# EAGLE design rain (EAGLE 6.5.0)
AUTHOR: Brad Campbell; REV: A; TITLE: Rain
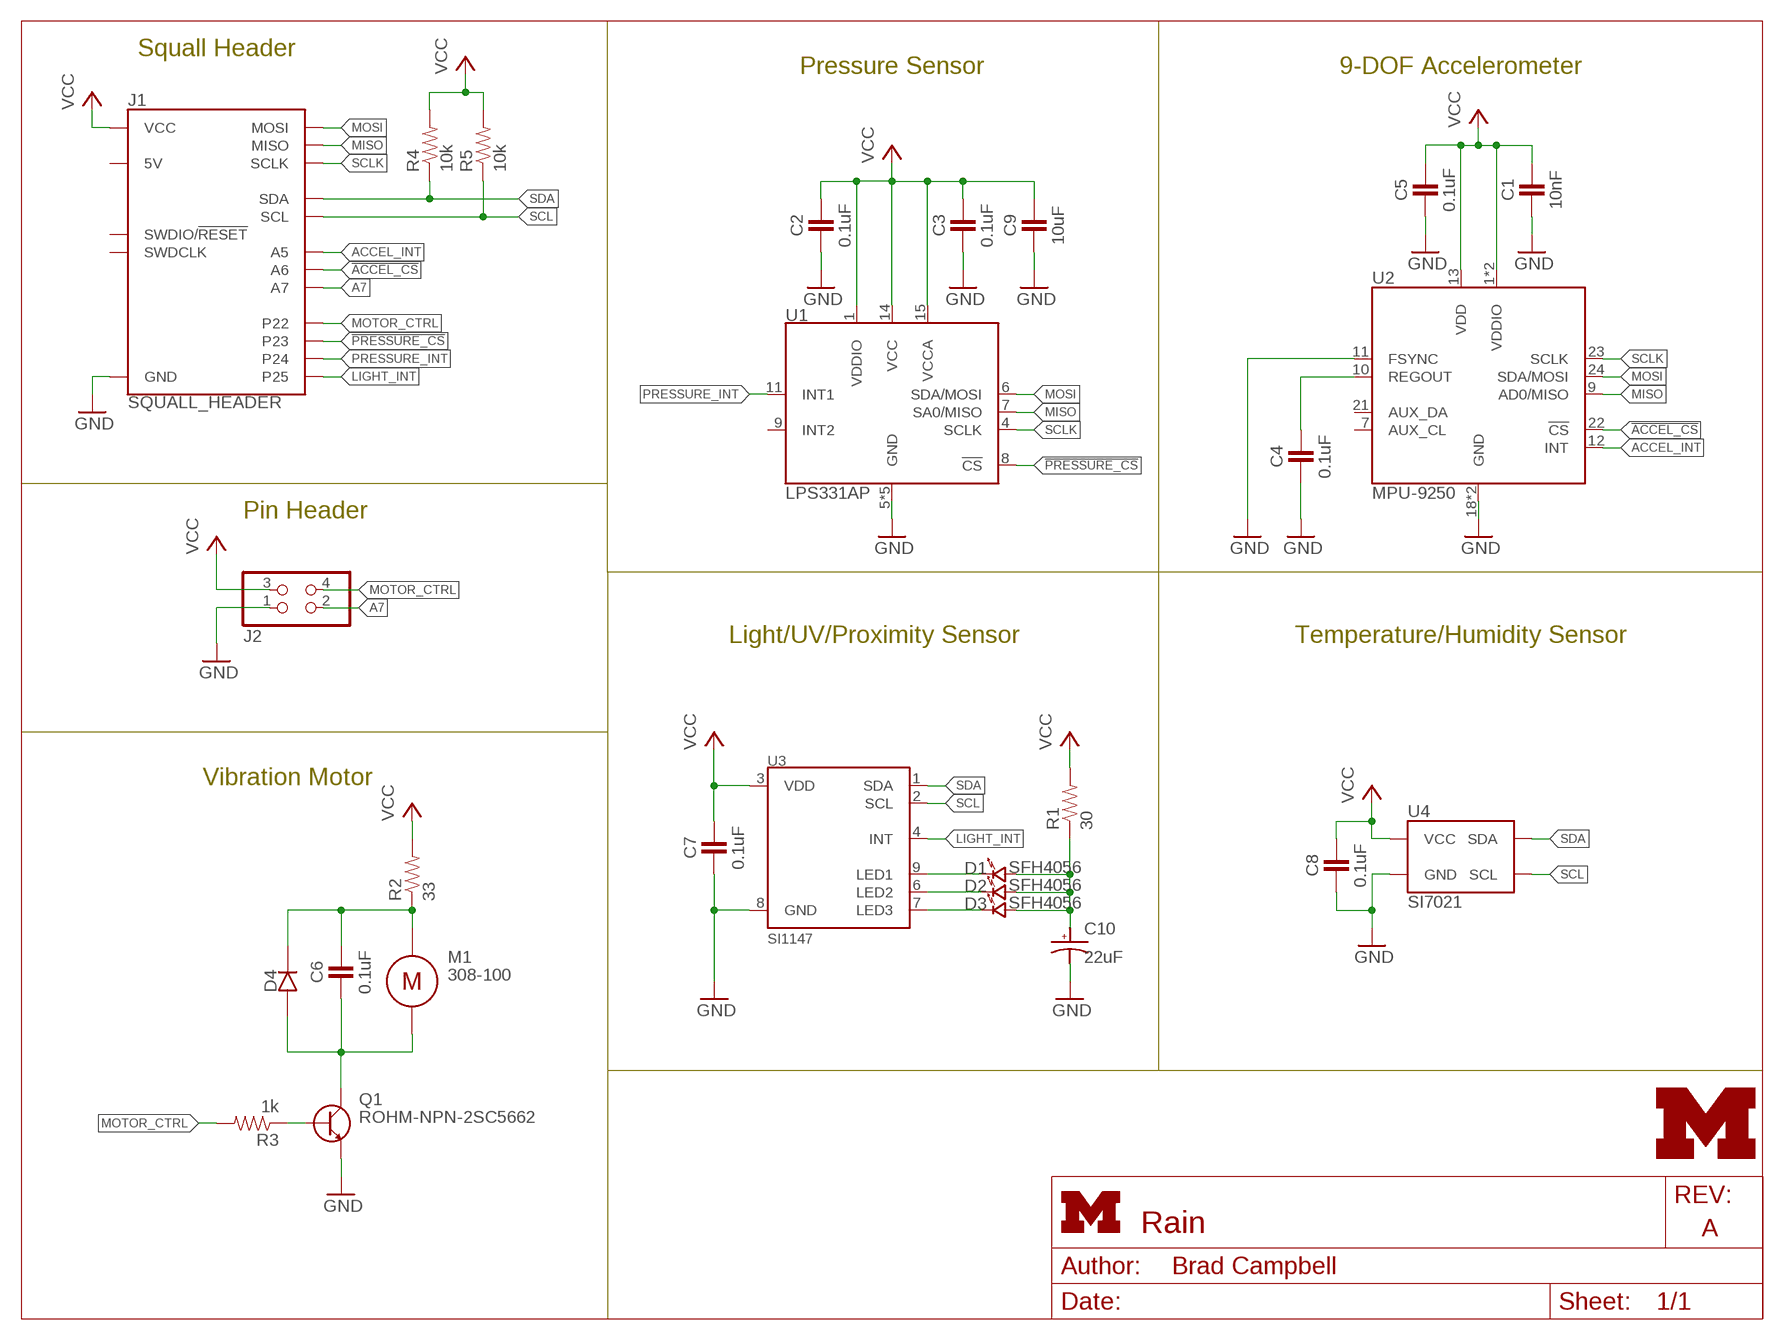
[diagram p0: schematic, sheet 1]
FRAME1 (LETTER_L): HEIGHT: 8.5in; WIDTH: 11in

## Parts
C1  10nF  CAPACITOR  [0402_CAP]
C2  0.1uF  CAPACITOR  [0402_CAP]
C3  0.1uF  CAPACITOR  [0402_CAP]
C4  0.1uF  CAPACITOR  [0402_CAP]
C5  0.1uF  CAPACITOR  [0402_CAP]
C6  0.1uF  CAPACITOR  [0402_CAP]
C7  0.1uF  CAPACITOR  [0402_CAP]
C8  0.1uF  CAPACITOR  [0402_CAP]
C9  10uF  CAPACITOR  [0402_CAP]
C10  22uF  CAP_POL0603  [CAP0603]
D1  SFH4056  [SFH4056]
D2  SFH4056  [SFH4056]
D3  SFH4056  [SFH4056]
D4  DIODE  [0402_DIODE]
J1  SQUALL_HEADER  [SQUALL_HEADER]
J2  PINHD-2X2  [2X02]
LOGO1  UMICH_SOLID_TINY  [UMICH_SOLID_50MIL]
M1  308-100  [308-100]
Q1  ROHM-NPN-2SC5662  [VMT3]
R1  30  RESISTOR0402_RES  [0402_RES]
R2  33  RESISTOR0402_RES  [0402_RES]
R3  1k  RESISTOR0402_RES  [0402_RES]
R4  10k  RESISTOR0402_RES  [0402_RES]
R5  10k  RESISTOR0402_RES  [0402_RES]
U1  LPS331AP  [HCLGA-16/3MM]
U2  MPU-9250  [QFN-24/3MM]
U3  SI1147  [QFN-10/2MM]
U4  SI7021  [DFN-6/3MM]

## Nets
!ACCEL_CS: J1.B7(A6) U2.22(!CS)
!PRESSURE_CS: J1.A4(P23) U1.8(!CS)
A7: J1.B5(A7) J2.2
ACCEL_INT: J1.B9(A5) U2.12(INT)
GND: C1.2 C2.2 C3.2 C4.2 C5.2 C7.2 C8.2 C9.2 C10.NEG(ANODE) J1.A9(GND) J1.A10(GND) J2.1 Q1.2(EMITTER) U1.5(GND) U1.10(GND) U1.12(GND) U1.13(GND) U1.16(GND) U2.11(FSYNC) U2.18(GND) U2.20(GND) U3.8(GND) U4.2(GND)
LIGHT_INT: J1.A8(P25) U3.4(INT)
MISO: J1.B8(MISO) U1.7(SA0/MISO) U2.9(AD0/MISO)
MOSI: J1.B6(MOSI) U1.6(SDA/MOSI) U2.24(SDA/MOSI)
MOTOR_CTRL: J1.A2(P22) J2.4 R3.2
N$1: C6.1 D4.CATHODE M1.POS R2.1
N$2: C6.2 D4.ANODE M1.NEG Q1.3(COLLECTOR)
N$3: C4.1 U2.10(REGOUT)
N$4: D1.CATHODE U3.9(LED1)
N$5: Q1.1(BASE) R3.1
N$6: D2.CATHODE U3.6(LED2)
N$7: D3.CATHODE U3.7(LED3)
N$8: C10.POS(CATHODE) D1.ANODE D2.ANODE D3.ANODE R1.1
PRESSURE_INT: J1.A6(P24) U1.11(INT1)
SCL: J1.B3(SCL) R5.1 U3.2(SCL) U4.6(SCL)
SCLK: J1.B10(SCLK) U1.4(SCLK) U2.23(SCLK)
SDA: J1.B1(SDA) R4.1 U3.1(SDA) U4.1(SDA)
VCC: C1.1 C2.1 C3.1 C5.1 C7.1 C8.1 C9.1 J1.A1(VCC) J1.A3(VCC) J2.3 R1.2 R2.2 R4.2 R5.2 U1.1(VDDIO) U1.14(VCC) U1.15(VCCA) U2.1(VDDIO) U2.8(VDDIO) U2.13(VDD) U3.3(VDD) U4.5(VCC)
Unconnected: J1.A5(5V) J1.A7(5V) J1.B2(SWDCLK) J1.B4(SWDIO/!RESET) U1.9(INT2) U2.7(AUX_CL) U2.21(AUX_DA)

## Notes on the sheet
- Squall Header
- Pressure Sensor | 9-DOF Accelerometer
- Pin Header
- Light/UV/Proximity Sensor | Temperature/Humidity Sensor
- Vibration Motor

## Library data of the parts
C1 = passives:CAPACITOR: 0402 Capacitor; DIGIKEY: 490-1312-1-ND
C2-C8 = passives:CAPACITOR: 0402 Capacitor; DIGIKEY: 490-1318-1-ND
C9 = passives:CAPACITOR: 0402 Capacitor; DIGIKEY: 445-8919-1-ND
C10 = passives:CAP_POL; DIGIKEY: 511-1493-1-ND
D1-D3 = leds:SFH4056: LED IR EMITTER 850NM; DIGIKEY: 475-3042-1-ND
D4 = passives:DIODE; DIGIKEY: 641-1277-1-nd
J1 = squall:SQUALL_HEADER: Header for a sensor board on top of the Squall BLE tag board. Requires two DF40C-10DS-0.4V(51).; DIGIKEY: H11617CT-ND
J2 = pinhead:PINHD-2X2: PIN HEADER; DIGIKEY: 609-3201-ND
LOGO1 = logos:UMICH_SOLID
M1 = motor:308-100: Pico Vibe 8mm Vibration Motor - 3mm Type; PRECISION_MICRODRIVES: 308-100
Q1 = fets:ROHM-NPN-2SC5662; DIGIKEY: 2SC5662T2LPCT-ND
R1 = passives:RESISTOR: Resistor Basic schematic elements and footprints for 0603, 1206, and PTH resistors.; DIGIKEY: RHM30CECT-ND
R2 = passives:RESISTOR: Resistor Basic schematic elements and footprints for 0603, 1206, and PTH resistors.; DIGIKEY: RHM33CECT-ND
R3 = passives:RESISTOR: Resistor Basic schematic elements and footprints for 0603, 1206, and PTH resistors.; DIGIKEY: RHM1.0KCECT-ND
R4 R5 = passives:RESISTOR: Resistor Basic schematic elements and footprints for 0603, 1206, and PTH resistors.; DIGIKEY: RHM10.0KCDCT-ND
U1 = chips:LPS331AP: IC PRESSURE SENSOR PIEZO 16HCLGA; DIGIKEY: 497-12927-1-ND
U2 = chips:MPU-9250: GYRO/ACCEL/COMPASS/9-AXIS; DIGIKEY: 1428-1019-1-ND
U3 = chips:SI1147: SENSOR DGTL UV INDEX 10QFN; DIGIKEY: 336-2624-1-ND
U4 = chips:SI7021: IC TEMP SENSOR RH 2% DFN; DIGIKEY: 336-2542-1-ND

## Board
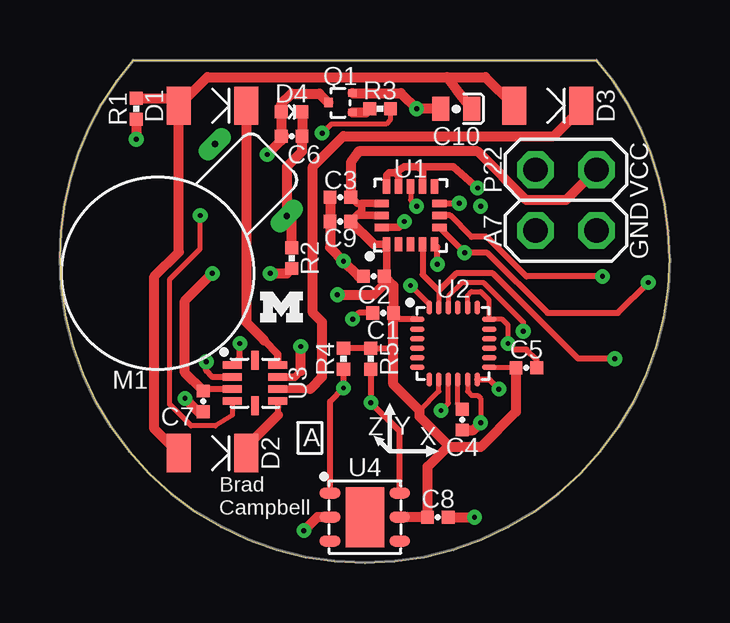
[diagram p1: board, top side]
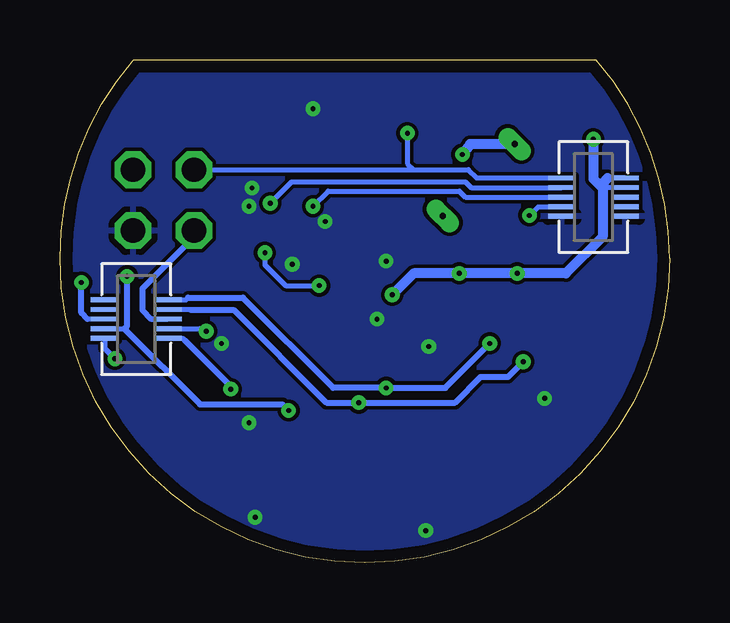
[diagram p2: board, bottom side, seen from below]

Size 25.4 x 20.95 mm. Coordinates in mm from the lower left corner, seen from the top.
Outline: 0,12.7 arc180 25.4,12.7 arc41 22.35,20.95 3.05,20.95 arc41 0,12.7
Copper layers (1*16): Top 0.0178mm / dielectric 59mil / Bottom 0.0178mm
Design rules "sunstone-2lyr_v1.0.0.3": minimum track width 6mil, minimum drill 14mil, track to track 6mil, track to pad 6mil, pad to pad 6mil, via to via 6mil, smd to smd 6mil, copper to edge 20mil, drill to drill 16mil, minimum pad ring 8mil, minimum via ring 8mil, stop-mask expansion 3mil, vias tented up to drill 0mil, thermal gap 10mil

### Footprints (pad centres in the part's own frame; a part is rotated, then mirrored left to right if it is on the bottom)
0402_CAP = smd 0.536 x 0.546: 1 -0.433,0; 2 0.433,0
CAP0603 = smd 0.7 x 1: NEG 0.65,0; POS -0.65,0
SFH4056 = smd 1 x 1.6: ANODE 1.4,0; CATHODE -1.4,0
0402_DIODE = smd 0.536 x 0.546: ANODE -0.433,0; CATHODE 0.433,0
SQUALL_HEADER = smd 1.14 x 0.2 bottom: A1 -10.845,3.34; A2 -8.205,3.34; A3 -10.845,2.94; A4 -8.205,2.94; A5 -10.845,2.54; A6 -8.205,2.54; A7 -10.845,2.14; A8 -8.205,2.14; A9 -10.845,1.74; A10 -8.205,1.74; B1 8.205,-1.74; B2 10.845,-1.74; B3 8.205,-2.14; B4 10.845,-2.14; B5 8.205,-2.54; B6 10.845,-2.54; B7 8.205,-2.94; B8 10.845,-2.94; B9 8.205,-3.34; B10 10.845,-3.34
2X02 = drill 1.016 octagon: 1 -1.27,-1.27; 2 -1.27,1.27; 3 1.27,-1.27; 4 1.27,1.27
308-100 = drill 0.26 pad 0.8 long: NEG -5.5,-2.119; POS -5.5,2.119
VMT3 = smd 0.3 x 0.35: 1 -0.4,-0.5; 2 0.4,-0.5 | smd 0.4 x 0.35: 3 0,0.5
0402_RES = smd 0.536 x 0.546: 1 -0.433,0; 2 0.433,0
HCLGA-16/3MM = smd 0.6 x 0.3: 1 -1.2,1; 2 -1.2,0.5; 3 -1.2,0; 4 -1.2,-0.5; 5 -1.2,-1; 9 1.2,-1; 10 1.2,-0.5; 11 1.2,0; 12 1.2,0.5; 13 1.2,1 | smd 0.3 x 0.6: 6 -0.5,-1.2; 7 0,-1.2; 8 0.5,-1.2; 14 0.5,1.2; 15 0,1.2; 16 -0.5,1.2
QFN-24/3MM = smd 0.6 x 0.23: 1 -1.5,1; 2 -1.5,0.6; 3 -1.5,0.2; 4 -1.5,-0.2; 5 -1.5,-0.6; 6 -1.5,-1; 13 1.5,-1; 14 1.5,-0.6; 15 1.5,-0.2; 16 1.5,0.2; 17 1.5,0.6; 18 1.5,1 | smd 0.23 x 0.6: 7 -1,-1.5; 8 -0.6,-1.5; 9 -0.2,-1.5; 10 0.2,-1.5; 11 0.6,-1.5; 12 1,-1.5; 19 1,1.5; 20 0.6,1.5; 21 0.2,1.5; 22 -0.2,1.5; 23 -0.6,1.5; 24 -1,1.5
QFN-10/2MM = smd 0.8 x 0.3: 1 -0.95,0.75; 2 -0.95,0.25; 3 -0.95,-0.25; 4 -0.95,-0.75; 6 0.95,-0.75; 7 0.95,-0.25; 8 0.95,0.25; 9 0.95,0.75 | smd 0.3 x 0.8: 5 0,-0.95; 10 0,0.95
DFN-6/3MM = smd 0.85 x 0.45: 1 -1.45,1; 2 -1.45,0; 3 -1.45,-1; 4 1.45,-1; 5 1.45,0; 6 1.45,1 | smd 1.6 x 2.5: P$1 0,0

### Placement (x,y rotation side)
C1  13.46,10.41 180 top
C2  13.08,11.94 180 top
C3  11.68,15.24 180 top
C4  16.76,5.97 270 top
C5  19.43,8.13 0 top
C6  9.65,17.78 180 top
C7  5.97,6.73 270 top
C8  15.75,1.91 0 top
C9  11.68,14.22 180 top
C10  16.51,18.92 180 top
D1  6.35,19.05 180 top
D2  6.35,4.57 180 top
D3  20.32,19.05 180 top
D4  9.65,18.8 0 top
J1  12.7,12.7 0 top
J2  21.08,15.11 90 top
LOGO1  9.22,10.67 0 top
M1  4.06,12.06 225 top
Q1  11.68,19.18 90 top
R1  3.17,18.92 270 top
R2  9.65,12.7 270 top
R3  13.34,18.92 0 top
R4  11.81,8.51 90 top
R5  12.95,8.51 90 top
U1  14.61,14.48 90 top
U2  16.38,9.14 0 top
U3  8.13,7.49 0 top
U4  12.7,1.91 0 top

### Tracks (layer width: path | path; a pad name or v marks a point on that pad's centre or on a via)
!ACCEL_CS  (via drill 0.2)
  Top 0.203: U2.22 16.18,11.1 16.76,11.68 17.65,11.68 19.3,10.03 v19.3,9.65
  Bottom 0.203: J1.B7 19.58,9.76 v19.3,9.65
!PRESSURE_CS  (via drill 0.2)
  Top 0.254: U1.8 16.63,14.98 v16.64,14.99
  Bottom 0.203: v16.64,14.99 15.75,15.88 8.51,15.88 8.27,15.64 J1.A4
A7
  Bottom 0.203: 21.59,10.16 J1.B5
  Bottom 0.254: J2.2 19.81,13.59 21.97,11.43 21.97,10.54 21.59,10.16
ACCEL_INT  (via drill 0.2)
  Top 0.254: U2.12 17.88,7.64 v18.29,7.24
  Bottom 0.203: J1.B9 20.28,9.36 20.19,9.27
  Bottom 0.254: 20.19,9.27 18.29,7.37 v18.29,7.24
GND  (via drill 0.2)
  Top 0.203: U2.11 16.98,7.15 17.14,6.99 17.4,6.99 17.53,6.86 v17.53,5.84 | U2.20 16.98,11.14 17.14,11.3 17.53,11.3 17.88,10.95 U2.18 18.43,10.14 18.67,9.91 v18.67,9.14
  Top 0.254: C5.2 19.86,8.46 19.43,8.89 18.92,8.89 v18.67,9.14 | v15.72,12.45 15.72,13.16 U1.5 | C1.2 12.45,10.41 v12.19,10.16
  Top 0.305: U1.13 13.61,16.14 13.72,16.26 13.97,16.26 | 13.97,16.26 14.11,16.12 U1.12 | U1.16 14.11,13.98 v14.35,14.22 | U1.10 15.11,16.39 14.86,16.51 | 14.86,16.51 14.35,16.51 13.97,16.26 | 14.86,16.51 16.38,16.51 v17.4,15.62 | U3.8 9.78,7.74 10.03,8
  Top 0.406: C2.2 12.45,11.94 v11.81,12.57 11.25,13.13 C9.2 C3.2 | C10.NEG v14.86,18.92 14.21,19.58 Q1.2 | 10.03,8 v10.03,9.02 | C8.2 v17.27,1.91 | C4.2 17.22,5.54 v17.53,5.84 | C7.2 5.77,6.3 v5.21,6.86 | U4.2 10.72,1.91 v10.16,1.35
  other vias: 17.53,14.86
  pour Bottom: -1.27,22.86 26.67,22.86 26.67,-1.27 -1.27,-1.27
LIGHT_INT  (via drill 0.2)
  Top 0.203: v5.84,14.48 5.84,13.08 4.57,11.81 4.57,6.6 5.46,5.71 6.48,5.71 7.18,6.16 U3.4
  Bottom 0.203: v5.84,14.48 5.48,14.84 J1.A8
MISO  (via drill 0.2)
  Top 0.203: U2.9 16.18,6.66 v15.88,6.35
  Top 0.254: v22.61,11.94 19.43,11.94 17.78,13.59 17.14,13.59 16.26,14.48 U1.7
  Bottom 0.203: J1.B8 22.71,9.76
  Bottom 0.254: v15.88,6.35 16.13,6.6 19.56,6.6 22.71,9.76 22.61,9.87 v22.61,11.94
MOSI  (via drill 0.2)
  Top 0.203: U2.24 15.38,10.78 v14.61,11.56
  Top 0.254: U1.6 v16.86,12.92 17.81,12.92 20.32,10.41 23.24,10.41 v24.51,11.68
  Bottom 0.203: J1.B6 24.26,10.16 | v16.86,12.92 16.86,12.41 16,11.56 v14.61,11.56
  Bottom 0.254: 24.26,10.16 24.51,10.41 v24.51,11.68
MOTOR_CTRL  (via drill 0.2)
  Top 0.203: R3.2 13.77,18.47 13.59,18.29 11.3,18.29 v10.92,17.91
  Bottom 0.203: J2.4 10.67,16.38 | 10.67,16.38 8.38,16.38 8.04,16.04 J1.A2 | v10.92,17.91 10.92,16.64 10.67,16.38
N$1
  Top 0.406: D4.CATHODE C6.1 10.09,17.14 9.45,16.51 M1.POS 9.65,14.26 R2.1
N$2  (via drill 0.2)
  Top 0.406: 9.35,17.78 C6.2 | C6.2 D4.ANODE 9.22,19.12 9.65,19.56 10.8,19.56 Q1.3 | v8.64,17.02 9.22,17.6 C6.2
  Bottom 0.406: M1.NEG 8.31,17.45 v8.64,17.02
N$3
  Top 0.203: C4.1 16.58,6.58 U2.10
N$4
  Top 0.305: 8.51,9.27 9.08,8.7 U3.9
  Top 0.406: D1.CATHODE 7.75,10.03 8.51,9.27
N$5
  Top 0.406: Q1.1 12.76,18.78 R3.1
N$6
  Top 0.254: U3.6 9.08,6.16
  Top 0.406: D2.CATHODE 7.75,4.83 9.08,6.16
N$7
  Top 0.305: 10.42,7.24 U3.7
  Top 0.406: D3.CATHODE 21.72,18.93 20.57,17.78 11.81,17.78 10.54,16.51 10.54,10.41 10.92,10.03 10.92,7.75 10.42,7.24
N$8
  Top 0.406: R1.1 4.64,19.36 D1.ANODE | D3.ANODE 17.73,20.24 16.13,20.24 | D1.ANODE 6.14,20.24 16.13,20.24 | C10.POS 16.52,19.72 16.13,20.24 | D1.ANODE 4.95,12.95 3.94,11.94 3.94,5.58 D2.ANODE
PRESSURE_INT  (via drill 0.2)
  Top 0.203: U1.11 14.61,15.11 v14.86,14.86
  Bottom 0.203: v14.86,14.86 14.22,15.49 8.76,15.49 8.51,15.24 J1.A6
SCL  (via drill 0.2)
  Top 0.254: R5.1 v12.95,6.68 14.15,5.48 U4.6 | U3.2 6.35,7.74 6.1,8 v6.1,8.38
  Bottom 0.203: J1.B3 19.96,10.56 19.94,10.54
  Bottom 0.254: 19.94,10.54 18.16,10.54 14.3,6.68 v12.95,6.68 8.94,6.68 7.87,7.75 6.73,7.75 v6.1,8.38
SCLK  (via drill 0.2)
  Top 0.203: 15.78,11.34 U2.23
  Top 0.254: v23.11,8.51 21.59,8.51 18.03,12.06 16.51,12.06 15.78,11.34 15.11,12.02 U1.4
  Bottom 0.203: J1.B10 23.55,8.94
  Bottom 0.254: 23.55,8.94 v23.11,8.51
SDA  (via drill 0.2)
  Top 0.254: 7.5,9.13 v7.49,9.14 7.49,8.56 U3.1 | R4.1 v11.81,7.29 11.25,6.73 U4.1
  Bottom 0.203: J1.B1 20.16,10.96 20.07,11.05
  Bottom 0.254: 20.07,11.05 17.78,11.05 14.02,7.29 v11.81,7.29 9.35,7.29 v7.49,9.14
VCC  (via drill 0.2)
  Top 0.203: U2.13 18.98,8.14 | 14.99,6.35 15.78,7.15 U2.8 | U2.1 14.87,10.16
  Top 0.254: C2.1 13.61,12.03 | 12.38,14.98 12.57,14.98 | 18.98,8.14 C5.1 | 16.26,4.83 16.19,4.89 | R4.2 R5.2 13.84,8.94 13.89,8.89 | U3.3 6.05,7.24 C7.1 | 14.87,10.16 14.15,10.16 C1.1
  Top 0.305: 13.61,12.03 U1.1 13.06,13.28 | C9.1 12.37,14.48 | 12.37,14.48 U1.15 | C3.1 12.38,14.98 | U1.14 12.57,14.98 12.57,14.68 12.37,14.48
  Top 0.406: U4.5 C8.1 15.31,4.01 16.19,4.89 14.99,6.1 14.99,6.35 13.89,7.44 13.89,8.89 C1.1 13.89,11.56 C2.1 13.51,11.61 13.08,11.18 v11.56,11.18 | C5.1 19,6.3 17.53,4.83 16.26,4.83 | 13.06,13.28 C9.1 | R1.2 v3.17,17.65 | C3.1 12.12,16.69 12.45,17.14 17.4,17.14 19.43,15.11 21.08,15.11 J2.3 | C7.1 5.21,7.93 5.21,10.92 v6.35,12.06 | v8.76,12.06 9.45,12.06 R2.2
  Bottom 0.203: J1.A3 2.65,15.64 | J1.A1 2.58,16.04
  Bottom 0.254: 2.65,15.64 2.79,15.79 2.79,15.82
  Bottom 0.406: 2.79,15.82 2.58,16.04 | 2.79,15.79 2.79,15.62 | 2.79,15.62 2.79,13.59 4.32,12.06 v6.35,12.06 v8.76,12.06 10.67,12.06 v11.56,11.18 | v3.17,17.65 3.17,16 2.79,15.62

### Text on the board
tPlace: P22 | VCC | A7 | GND | Z | Y | A | X | Brad / Campbell